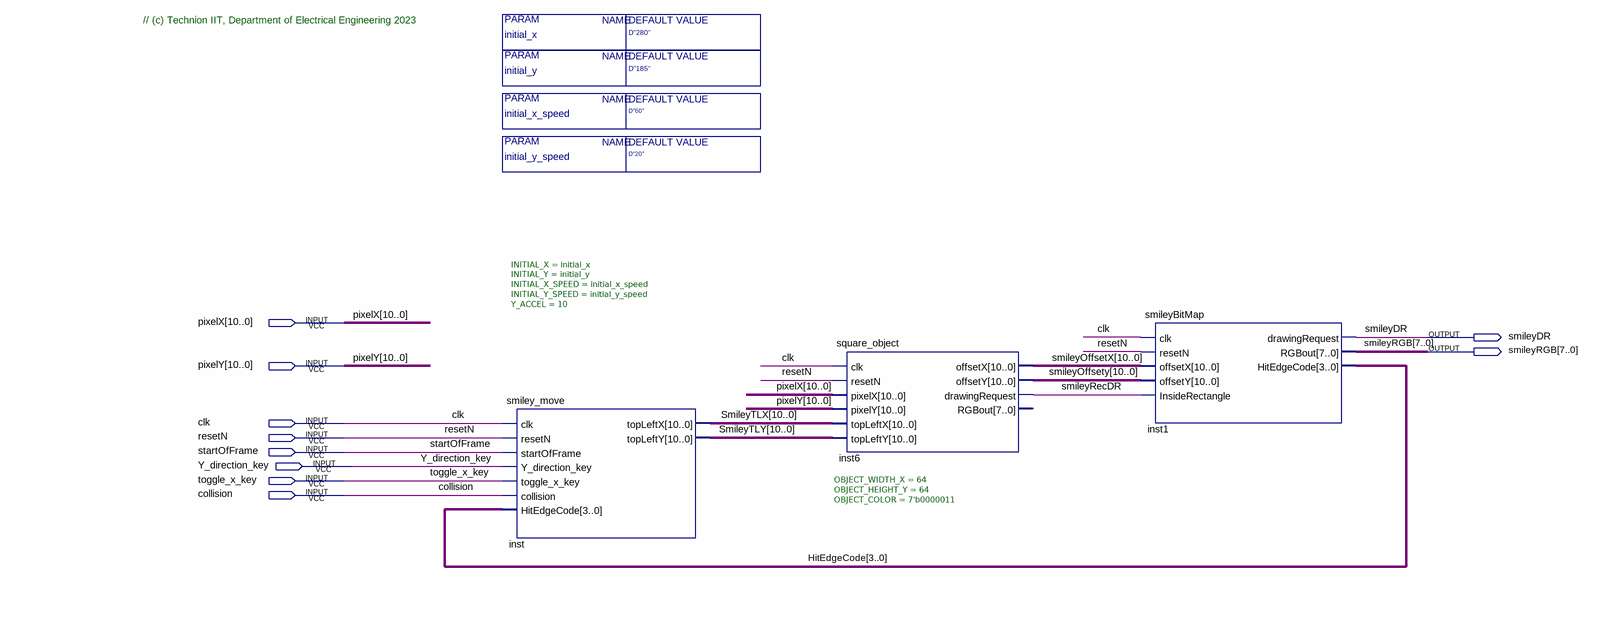
[diagram p0: schematic sheet]
// Quartus schematic Smiley_Block_T.bdf as structural Verilog: 3 symbols, 10 pins
module Smiley_Block_T #(parameter initial_x = "D\"280\"", parameter initial_y = "D\"185\"", parameter initial_x_speed = "D\"60\"", parameter initial_y_speed = "D\"20\"") (
  input  [10:0] pixelX,
  input  [10:0] pixelY,
  input  clk,
  input  resetN,
  input  startOfFrame,
  input  Y_direction_key,
  input  toggle_x_key,
  input  collision,
  output smileyDR,
  output [7:0] smileyRGB
);

  wire smileyRecDR;
  wire [3:0] HitEdgeCode;
  wire [10:0] smileyOffsetX, smileyOffsety, SmileyTLX, SmileyTLY;

  smiley_move #(.INITIAL_X(initial_x), .INITIAL_Y(initial_y), .INITIAL_X_SPEED(initial_x_speed), .INITIAL_Y_SPEED(initial_y_speed), .Y_ACCEL(10)) inst (
    .clk(clk), .resetN(resetN), .startOfFrame(startOfFrame), .Y_direction_key(Y_direction_key),
    .toggle_x_key(toggle_x_key), .collision(collision), .HitEdgeCode(HitEdgeCode), .topLeftX(SmileyTLX),
    .topLeftY(SmileyTLY));
  square_object #(.OBJECT_WIDTH_X(64), .OBJECT_HEIGHT_Y(64), .OBJECT_COLOR(7'b0000011)) inst6 (
    .clk(clk), .resetN(resetN), .pixelX(pixelX), .pixelY(pixelY), .topLeftX(SmileyTLX), .topLeftY(SmileyTLY),
    .offsetX(smileyOffsetX), .offsetY(smileyOffsety), .drawingRequest(smileyRecDR));  // open: RGBout
  smileyBitMap inst1 (
    .clk(clk), .resetN(resetN), .offsetX(smileyOffsetX), .offsetY(smileyOffsety),
    .InsideRectangle(smileyRecDR), .drawingRequest(smileyDR), .RGBout(smileyRGB), .HitEdgeCode(HitEdgeCode));

  // Notes on the sheet:
  //   // (c) Technion IIT, Department of Electrical Engineering 2023
endmodule
